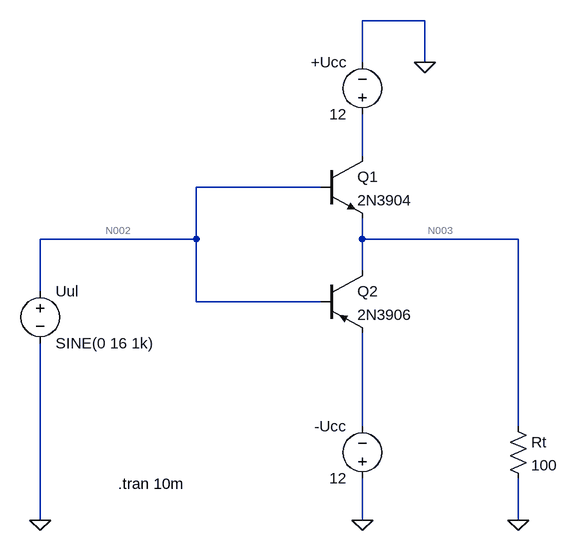
[diagram p0: schematic SPOJ B - LH - SIM.asc]
SPOJ B - LH - SIM.asc, the LTspice schematic file:
Version 4.1
SHEET 1 884 680
WIRE 672 -224 576 -224
WIRE 576 -160 576 -224
WIRE 672 -160 672 -224
WIRE 576 -16 576 -80
WIRE 512 32 320 32
WIRE 320 112 320 32
WIRE 320 112 80 112
WIRE 576 112 576 80
WIRE 816 112 576 112
WIRE 576 160 576 112
WIRE 80 192 80 112
WIRE 320 208 320 112
WIRE 512 208 320 208
WIRE 576 400 576 256
WIRE 816 400 816 112
WIRE 80 544 80 272
WIRE 576 544 576 480
WIRE 816 544 816 480
FLAG 672 -160 0
FLAG 576 544 0
FLAG 80 544 0
FLAG 816 544 0
SYMBOL voltage 80 176 R0
WINDOW 123 0 0 Left 0
WINDOW 39 0 0 Left 0
SYMATTR InstName Uul
SYMATTR Value SINE(0 16 1k)
SYMBOL npn 512 -16 R0
SYMATTR InstName Q1
SYMATTR Value 2N3904
SYMBOL pnp 512 160 R0
SYMATTR InstName Q2
SYMATTR Value 2N3906
SYMBOL voltage 576 496 R180
WINDOW 0 24 96 Left 2
WINDOW 3 24 16 Left 2
WINDOW 123 0 0 Left 0
WINDOW 39 0 0 Left 0
SYMATTR InstName -Ucc
SYMATTR Value 12
SYMBOL voltage 576 -64 R180
WINDOW 0 24 96 Left 2
WINDOW 3 24 16 Left 2
WINDOW 123 0 0 Left 0
WINDOW 39 0 0 Left 0
SYMATTR InstName +Ucc
SYMATTR Value 12
SYMBOL res 800 384 R0
SYMATTR InstName Rt
SYMATTR Value 100
TEXT 200 488 Left 2 !.tran 10m

The netlist it stands for:
* SPOJ B - LH - SIM.asc
V§Uul N002 0 SINE(0 16 1k)
Q1 N001 N002 N003 0 2N3904
Q2 N003 N002 N004 0 2N3906
V§-Ucc 0 N004 12
V§+Ucc N001 0 12
Rt N003 0 100
.model NPN NPN
.model PNP PNP
.lib standard.bjt
.tran 10m
.backanno
.end

* Results of the author's LTspice run, read from the files saved beside the schematic
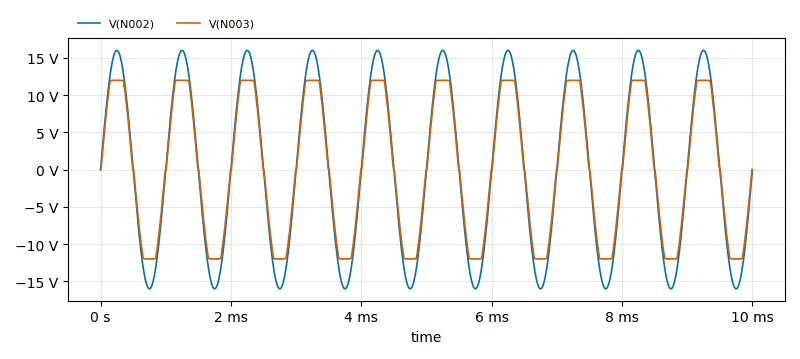
[diagram p1: Transient Analysis of SPOJ B - LH - SIM.asc, plotted from the saved traces]
* Transient Analysis, 1 run:
*   V(N002): min -16 V, max 16 V, average -2.644 µV, rms 11.31 V, last 0 V
*   V(N003): min -11.99 V, max 11.98 V, average 68.28 mV, rms 9.382 V, last -26.41 mV